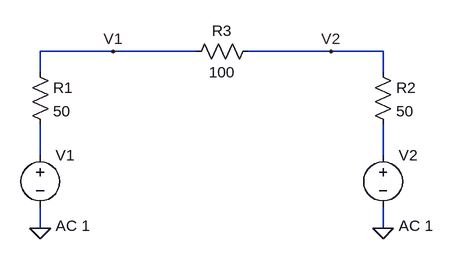
[diagram p0: schematic SParameterExtract.asc]
SParameterExtract.asc, the LTspice schematic file:
Version 4
SHEET 1 880 680
WIRE 160 -32 48 -32
WIRE 288 -32 160 -32
WIRE 496 -32 368 -32
WIRE 576 -32 496 -32
WIRE 48 0 48 -32
WIRE 576 0 576 -32
WIRE 48 128 48 80
WIRE 576 128 576 80
WIRE 48 240 48 208
WIRE 576 240 576 208
FLAG 48 240 0
FLAG 576 240 0
FLAG 160 -32 V1
FLAG 496 -32 V2
SYMBOL voltage 48 112 R0
WINDOW 123 24 124 Left 2
WINDOW 39 0 0 Left 0
SYMATTR InstName V1
SYMATTR Value ""
SYMATTR Value2 AC 1
SYMBOL res 32 -16 R0
SYMATTR InstName R1
SYMATTR Value 50
SYMBOL voltage 576 112 R0
WINDOW 123 24 124 Left 2
WINDOW 39 0 0 Left 0
SYMATTR InstName V2
SYMATTR Value ""
SYMATTR Value2 AC 1
SYMBOL res 560 -16 R0
SYMATTR InstName R2
SYMATTR Value 50
SYMBOL res 384 -48 R90
WINDOW 0 0 56 VBottom 2
WINDOW 3 32 56 VTop 2
SYMATTR InstName R3
SYMATTR Value 100

The netlist it stands for:
* SParameterExtract.asc
V1 N001 0 AC 1
R1 V1 N001 50
V2 N002 0 AC 1
R2 V2 N002 50
R3 V2 V1 100
.backanno
.end